# EasyEDA Pro project ProPrj_PCB_Strap_TUT_2025-08-09.epro

# Board PCB Strap TUT
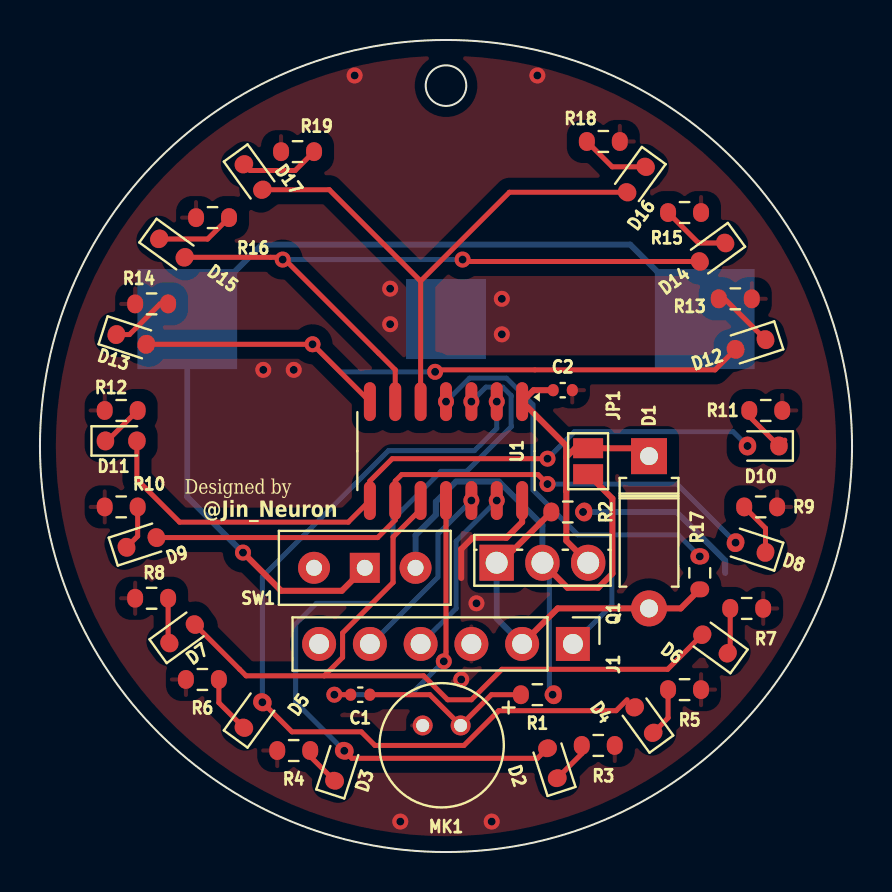
[diagram p0: board, top side]
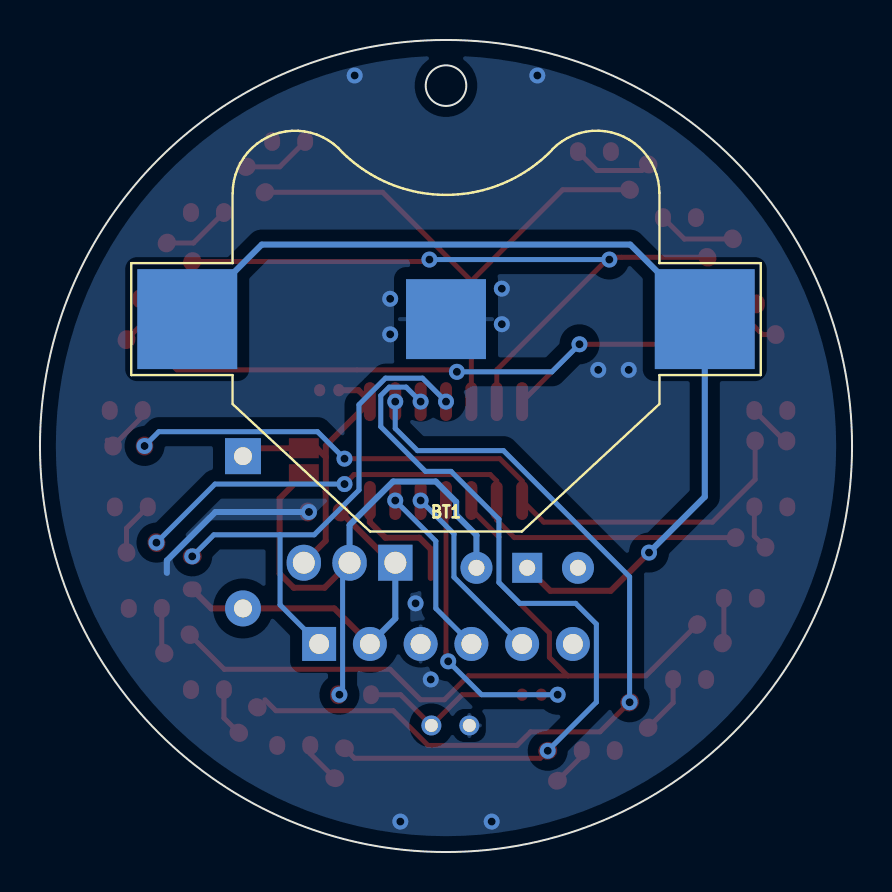
[diagram p1: board, bottom side, seen from below]

Outline 40.64 x 40.64 mm; copper layers: Top Layer, Bottom Layer. Coordinates in mm from the lower left corner of the outline.
Outline path: circle c20.32,38.35 r1.02 ; circle c20.32,20.32 r20.32
Stack: Top Layer 0.035mm / Dielectric1 1.51mm FR4 er 4.5 / Bottom Layer 0.035mm

## Design rules (mm)
spacing safeClearance (default): track to track 0.152, other pairs 0.152 to 0.3
track width trackWidth (default): min 0.127, default 0.254, max 2.54
differential pair differentialPair (default): width min 0.127, default 0.254, max 2.54; gap min 0.152, default 0.152
via viaSize (default): diameter min 0.5, default 0.61, max 10; hole min 0.3, default 0.305, max 6
net GND uses CopperRegion1
pour ie689 uses CopperRegion
pour ie690 uses CopperRegion1

## Placement (name value [footprint] x y rotation side)
BT1  CoinBattery  [Battery:BatteryHolder_Multicomp_BC-2001_1x2032]  20.32 26.67 180 bottom
C1  4.7u  [Capacitor_SMD:C_0402_1005Metric]  16.03 7.87 180 top
C2  104  [Capacitor_SMD:C_0402_1005Metric]  26.16 23.11 0 top
D1  D  [Diode_THT:D_A-405_P7.62mm_Horizontal]  30.48 19.81 270 top
D2  LED  [LED_SMD:LED_0603_1608Metric]  25.64 4.44 108 top
D3  LED  [LED_SMD:LED_0603_1608Metric]  14.99 4.32 72 top
D4  LED  [LED_SMD:LED_0603_1608Metric]  30.23 6.6 126 top
D5  LED  [LED_SMD:LED_0603_1608Metric]  10.67 6.86 54 top
D6  LED  [LED_SMD:LED_0603_1608Metric]  33.78 10.41 144 top
D7  LED  [LED_SMD:LED_0603_1608Metric]  7.11 10.92 36 top
D8  LED  [LED_SMD:LED_0603_1608Metric]  35.56 15.24 162 top
D9  LED  [LED_SMD:LED_0603_1608Metric]  5.08 15.49 18 top
D10  LED  [LED_SMD:LED_0603_1608Metric]  36.19 20.32 180 top
D11  LED  [LED_SMD:LED_0603_1608Metric]  4.06 20.57 0 top
D12  LED  [LED_SMD:LED_0603_1608Metric]  35.56 25.4 198 top
D13  LED  [LED_SMD:LED_0603_1608Metric]  4.57 25.65 342 top
D14  LED  [LED_SMD:LED_0603_1608Metric]  33.66 30.02 216 top
D15  LED  [LED_SMD:LED_0603_1608Metric]  6.6 30.23 324 top
D16  LED  [LED_SMD:LED_0603_1608Metric]  29.84 33.65 234 top
D17  LED  [LED_SMD:LED_0603_1608Metric]  10.67 33.78 306 top
J1  Debug  [Connector_PinHeader_2.54mm:PinHeader_1x06_P2.54mm_Vertical]  26.67 10.41 270 top
JP1  POW_{SEL}  [Jumper:SolderJumper-2_P1.3mm_Bridged_Pad1.0x1.5mm]  27.43 19.56 90 top
MK1  ECM  [Sensor_Audio:POM-2244P-C3310-2-R]  19.15 6.33 0 top
Q1  Q_PMOS_GDS  [Package_TO_SOT_THT:TO-251-3_Vertical]  22.86 14.48 0 top
R1  2.2k  [Resistor_SMD:R_0603_1608Metric]  24.89 7.87 180 top
R2  100k  [Resistor_SMD:R_0603_1608Metric]  26.42 17.02 0 top
R3  1k  [Resistor_SMD:R_0603_1608Metric]  27.94 5.33 0 top
R4  1k  [Resistor_SMD:R_0603_1608Metric]  12.7 5.08 180 top
R5  1k  [Resistor_SMD:R_0603_1608Metric]  32.26 8.13 0 top
R6  1k  [Resistor_SMD:R_0603_1608Metric]  8.13 8.64 180 top
R7  1k  [Resistor_SMD:R_0603_1608Metric]  35.37 12.19 0 top
R8  1k  [Resistor_SMD:R_0603_1608Metric]  5.59 12.7 180 top
R9  1k  [Resistor_SMD:R_0603_1608Metric]  36.07 17.27 0 top
R10  1k  [Resistor_SMD:R_0603_1608Metric]  4.06 17.27 180 top
R11  1k  [Resistor_SMD:R_0603_1608Metric]  36.32 22.1 0 top
R12  1k  [Resistor_SMD:R_0603_1608Metric]  4.06 22.1 180 top
R13  1k  [Resistor_SMD:R_0603_1608Metric]  34.8 27.69 0 top
R14  1k  [Resistor_SMD:R_0603_1608Metric]  5.59 27.43 180 top
R15  1k  [Resistor_SMD:R_0603_1608Metric]  32.26 32 0 top
R16  1k  [Resistor_SMD:R_0603_1608Metric]  8.64 31.75 180 top
R17  5k  [Resistor_SMD:R_0603_1608Metric]  33.02 13.97 270 top
R18  1k  [Resistor_SMD:R_0603_1608Metric]  28.19 35.56 0 top
R19  1k  [Resistor_SMD:R_0603_1608Metric]  12.89 35.05 180 top
SW1  SW_SPST  [Button_Switch_THT:SW_Slide-03_Wuerth-WS-SLTV_10x2.5x6.4_P2.54mm]  16.26 14.22 180 top
U1  PIC16F1503-ISL  [Package_SO:SOIC-14_3.9x8.7mm_P1.27mm]  20.32 20.07 270 top

## Footprints (pads in the part's own frame, mm; a bottom-side part is the same pattern mirrored in y, then rotated)
Battery:BatteryHolder_Multicomp_BC-2001_1x2032
  rect 5x5 smd: 1(-12.95,0) 1(12.95,0)
  rect 4x4 smd: 2(0,0)
Button_Switch_THT:SW_Slide-03_Wuerth-WS-SLTV_10x2.5x6.4_P2.54mm
  rect 1.5x1.5 hole 0.8: 1(0,0)
  round 1.6 hole 0.8: 2(-2.54,0) 3(2.54,0)
Capacitor_SMD:C_0402_1005Metric
  rrect 0.56x0.62 smd: 1(-0.48,0) 2(0.48,0)
Connector_PinHeader_2.54mm:PinHeader_1x06_P2.54mm_Vertical
  rect 1.7x1.7 hole 1: 1(0,0)
  round 1.7 hole 1: 2(0,-2.54) 3(0,-5.08) 4(0,-7.62) 5(0,-10.16) 6(0,-12.7)
Diode_THT:D_A-405_P7.62mm_Horizontal
  rect 1.8x1.8 hole 0.9: 1(0,0)
  round 1.8 hole 0.9: 2(7.62,0)
Jumper:SolderJumper-2_P1.3mm_Bridged_Pad1.0x1.5mm
  rect 1x1.5 smd: 1(-0.65,0) 2(0.65,0)
LED_SMD:LED_0603_1608Metric
  rrect 0.875x0.95 smd: 1(-0.787,0) 2(0.787,0)
Package_SO:SOIC-14_3.9x8.7mm_P1.27mm
  rrect 1.95x0.6 smd: 1(-2.475,3.81) 2(-2.475,2.54) 3(-2.475,1.27) 4(-2.475,0) 5(-2.475,-1.27) 6(-2.475,-2.54) 7(-2.475,-3.81) 8(2.475,-3.81) 9(2.475,-2.54) 10(2.475,-1.27) 11(2.475,0) 12(2.475,1.27) 13(2.475,2.54) 14(2.475,3.81)
Package_TO_SOT_THT:TO-251-3_Vertical
  rect 1.718x1.8 hole 1.1: 1(0,0)
  oval 1.718x1.8 hole 1.1: 2(2.29,0) 3(4.58,0)
Resistor_SMD:R_0603_1608Metric
  rrect 0.8x0.95 smd: 1(-0.825,0) 2(0.825,0)
Sensor_Audio:POM-2244P-C3310-2-R
  rrect 1x1 hole 0.65: 1(0,0)
  round 1 hole 0.65: 2(1.9,0)

## Nets
+3V0: JP1.1 Q1.2 R1.1 SW1.2
+5V: D1.2 J1.2 Q1.1 R2.1 R17.2
GND: BT1.2 C2.2 J1.3 MK1.1 R2.2 R3.2 R4.2 R5.2 R6.2 R7.2 R8.2 R9.2 R10.2 R11.2 R12.2 R13.2 R14.2 R15.2 R16.2 R18.2 R19.2 U1.14
VCC: C2.1 D1.1 JP1.2 Q1.3 U1.1
/PGC: J1.5 U1.12
/PGD: J1.4 U1.13
/RA2: C1.2 U1.11
/RA4: D2.2 D3.2 U1.3
/RA5: D4.2 D5.2 U1.2
/RC0: D6.2 D7.2 U1.10
/RC1: D8.2 D9.2 U1.9
/RC2: D10.2 D11.2 U1.8
/RC3: D12.2 D13.2 U1.7
/RC4: D14.2 D15.2 U1.6
/RC5: D16.2 D17.2 U1.5
/~{CLR}: J1.1 R17.1 U1.4
NET-(BT1-+): BT1.1 SW1.1
NET-(D2-K): D2.1 R3.1
NET-(D3-K): D3.1 R4.1
NET-(D4-K): D4.1 R5.1
NET-(D5-K): D5.1 R6.1
NET-(D6-K): D6.1 R7.1
NET-(D7-K): D7.1 R8.1
NET-(D8-K): D8.1 R9.1
NET-(D9-K): D9.1 R10.1
NET-(D10-K): D10.1 R11.1
NET-(D11-K): D11.1 R12.1
NET-(D12-K): D12.1 R13.1
NET-(D13-K): D13.1 R14.1
NET-(D14-K): D14.1 R15.1
NET-(D15-K): D15.1 R16.1
NET-(D16-K): D16.1 R18.1
NET-(D17-K): D17.1 R19.1
NET-(MK1-+): C1.1 MK1.2 R1.2
UNCONNECTED-(J1-PIN_6-PAD6): J1.6

Pads without a net: SW1 3

## Via types
v1: diameter 0.8, hole 0.4, Top Layer to Bottom Layer, 33 vias

## Routing (per net, layer and track width the routed paths; a pad name or vN(x,y) marks a point on that pad's centre or on a via; arc(x,y) is an arc through that point)
+3V0: length 29.1
  Top Layer w0.3: Q1.2 26.4,13.23 27.94,13.23 28.65,13.94 28.65,17.69 JP1.1
  Bottom Layer w0.25: Q1.2 25.5,14.13 25.5,8.03 v1(25.65,7.87)
  Bottom Layer w0.3: 25.47,14.15 Q1.2 25.15,16.37 22.97,18.54 20.83,18.54 19.81,17.53 19.81,16.87 18.8,15.86 18.8,14.48
+5V: length 18.4
  Top Layer w0.3: J1.2 25.91,12.19 D1.2 32.07,12.19 R17.2 ; R2.1 23.05,14.48 Q1.1
  Bottom Layer w0.3: Q1.1 22.86,11.69 J1.2
GND: length 14.9
  Top Layer w0.3: U1.14 24.13,16.51 23.35,15.73 21.65,15.73 21.08,15.16 21.08,13.72
  Bottom Layer w0.3: 34.29,13.97 34.29,14.59 31.86,17.02 v1(27.18,17.02)
  vias: v1(11.18,24.13) v1(12.7,24.13) v1(15.75,38.86) v1(17.53,28.19) v1(17.53,26.42) v1(18.03,1.52) v1(21.08,8.64) v1(21.84,12.45) v1(22.61,1.52) v1(23.11,27.69) v1(23.11,25.91) v1(24.89,38.86)
VCC: length 15.7
  Top Layer w0.3: D1.1 30.08,20.21 JP1.2 26.78,20.21 26.33,19.76 ; 26.33,19.76 26.33,18.06 26.34,18.05 26.34,15.58 27.44,14.48 ; 26.33,19.76 26.33,20.34 24.13,22.54 24.7,23.11 25.64,23.11
/PGC: length 9.6
  Bottom Layer w0.25: J1.5 16.58,10.41 19.92,13.76 19.92,15.92 v1(21.59,17.59) ; 16.51,10.92 16.83,10.92
/PGD: length 8.8
  Bottom Layer w0.25: J1.4 20.83,12.19 20.83,15.56 v1(22.86,17.59)
/RA2: length 14.8
  Top Layer w0.25: U1.11 20.32,9.65 v1(20.21,9.54) ; C1.2 v1(14.73,7.87)
  Bottom Layer w0.25: 14.97,7.87 18.54,7.87 v1(20.21,9.54)
/RA4: length 38.6
  Top Layer w0.25: D2.2 24.9,4.69 15.61,4.69 v1(15.23,5.07)
  Bottom Layer w0.25: v1(15.23,5.07) 12.79,7.5 12.79,11.41 13.83,12.45 16.63,12.45 17.67,13.49 17.67,16.65 20.07,19.05 21.35,19.05 23.58,21.29 23.58,22.84 23.16,23.27 22.31,23.27 v1(21.59,22.54)
/RA5: length 42.5
  Top Layer w0.25: 29.38,7.62 28.83,7.07 22.96,7.07 21.22,5.33 16.76,5.33 16.08,6.02 12.61,6.02 v1(11.13,7.49)
  Bottom Layer w0.25: v1(11.13,7.49) 11.13,13.78 17.44,20.09 21.75,20.09 22.86,21.2 v1(22.86,22.54)
/RC0: length 39.1
  Top Layer w0.25: 14.22,8.82 10.31,8.82 7.75,11.38 ; 14.22,8.82 15.14,9.74 15.14,10.96 17.67,13.49 17.67,15.77 19.05,17.14 U1.10 ; 14.22,8.82 19.2,8.82 20.4,7.62 21.59,7.62 23.11,9.14 31.41,9.14 33.14,10.88
/RC1: length 32.8
  Top Layer w0.25: D9.2 16.9,15.74 17.78,16.62 U1.9 17.78,18.57 18.1,18.89 24.92,18.89 v1(25.4,18.41)
  Bottom Layer w0.25: v1(34.81,15.48) 31.88,18.41 v1(25.4,18.41)
/RC2: length 36.1
  Top Layer w0.25: v1(25.4,19.68) 17.63,19.68 16.51,18.57 U1.8 15.43,16.51 6.98,16.51 4.85,18.64 D11.2
  Bottom Layer w0.25: v1(25.4,19.68) 26.75,21.04 34.69,21.04 v1(35.41,20.32)
/RC3: length 34.6
  Top Layer w0.25: D12.2 33.78,24.13 19.87,24.13 v1(19.78,24.03) ; 16.51,22.54 v1(13.64,25.41) D13.2
  Bottom Layer w0.25: v1(19.78,24.03) 15.02,24.03 v1(13.64,25.41)
/RC4: length 35.4
  Top Layer w0.25: D14.2 21.25,29.55 v1(21.15,29.65) ; 7.24,29.76 12.15,29.76 17.78,24.13 17.78,22.54
  Bottom Layer w0.25: v1(21.15,29.65) v1(12.15,29.65)
/RC5: length 28
  Top Layer w0.25: D16.2 23.49,33.02 19.05,28.57 ; 19.05,22.54 19.05,28.57 ; 19.05,28.57 14.48,33.14 11.13,33.14
/~{CLR}: length 25.7
  Bottom Layer w0.25: v1(20.32,22.54) 21.5,23.72 23.35,23.72 24.67,22.39 24.67,18.12 26.91,15.88 28.62,15.88 ; 28.62,15.88 28.62,12.37 J1.1 ; 28.62,15.88 31.94,15.88 v1(33.02,14.79)
NET-(BT1-+): length 49.7
  Top Layer w0.3: v1(10.16,14.99) 12.07,13.07 15.11,13.07 SW1.1
  Bottom Layer w0.3: BT1.1 29.54,30.4 11.1,30.4 BT1.1 7.37,17.78 v1(10.16,14.99) ; 16.26,14.48 15.75,14.48
NET-(D2-K): length 2.1
  Top Layer w0.25: D2.1 27.11,4.92 R3.1
NET-(D3-K): length 2
  Top Layer w0.25: D3.1 13.53,4.79 R4.1
NET-(D4-K): length 2.5
  Top Layer w0.25: R5.1 31.43,6.71 D4.1
NET-(D5-K): length 2.9
  Top Layer w0.25: 10.2,6.22 8.95,7.47 R6.1
NET-(D6-K): length 2.3
  Top Layer w0.25: R7.1 34.54,10.08 34.42,9.95
NET-(D7-K): length 2.3
  Top Layer w0.25: 6.47,10.46 6.41,10.52 R8.1
NET-(D8-K): length 2.7
  Top Layer w0.25: D8.1 36.31,16.21 R9.1
NET-(D9-K): length 2.3
  Top Layer w0.25: R10.1 4.89,15.81 D9.1
NET-(D10-K): length 2.8
  Top Layer w0.25: 37.28,20.61 D10.1 35.5,21.81 35.5,22.1
NET-(D11-K): length 2.4
  Top Layer w0.25: 3.17,20.68 D11.1 3.36,20.57 R12.1
NET-(D12-K): length 3.2
  Top Layer w0.25: 33.97,27.69 34.27,27.69 D12.1
NET-(D13-K): length 3.2
  Top Layer w0.25: 3.82,25.9 4.48,25.9 6.01,27.43 R14.1
NET-(D14-K): length 3.5
  Top Layer w0.25: D14.1 32.96,30.48 R15.1
NET-(D15-K): length 3.9
  Top Layer w0.25: R16.1 8.39,30.68 5.98,30.68 5.97,30.69
NET-(D16-K): length 3.5
  Top Layer w0.25: R18.1 28.64,34.29 D16.1
NET-(D17-K): length 4
  Top Layer w0.25: R19.1 12.77,34.11 10.52,34.11 10.2,34.42
NET-(MK1-+): length 8.8
  Top Layer w0.25: R1.2 22.59,7.87 MK1.2 19.51,7.87 16.52,7.87

## Copper pours and planes (outline as drawn; the poured copper is in the pictures)
GND on Top Layer: 40.15,20.32 40.13,21.21 40.07,22.1 39.97,22.98 39.83,23.86 39.65,24.73 39.43,25.59 39.18,26.45 38.88,27.29 38.55,28.11 38.18,28.92 37.78,29.71 37.34,30.49 36.87,31.24 36.36,31.97 35.82,32.68 35.25,33.36 34.65,34.02 34.02,34.65 33.36,35.25 32.68,35.82 31.97,36.36 31.24,36.87 30.49,37.34 29.72,37.78 28.92,38.18 28.11,38.55 27.29,38.88 26.45,39.18 25.59,39.43 24.73,39.65 23.86,39.83 22.98,39.97 22.1,40.07 21.21,40.13 20.32,40.15 19.43,40.13 18.54,40.07 17.66,39.97 16.78,39.83 15.91,39.65 15.05,39.43 14.19,39.18 13.35,38.88 12.53,38.55 11.72,38.18 10.92,37.78 10.15,37.34 9.4,36.87 8.67,36.36 7.96,35.82 7.28,35.25 6.62,34.65 5.99,34.02 5.39,33.36 4.82,32.68 4.28,31.97 3.77,31.24 3.3,30.49 2.86,29.71 2.46,28.92 2.09,28.11 1.76,27.29 1.46,26.45 1.21,25.59 0.99,24.73 0.81,23.86 0.67,22.98 0.57,22.1 0.51,21.21 0.49,20.32 0.51,19.43 0.57,18.54 0.67,17.66 0.81,16.78 0.99,15.91 1.21,15.05 1.46,14.19 1.76,13.35 2.09,12.53 2.46,11.72 2.86,10.92 3.3,10.15 3.77,9.4 4.28,8.67 4.82,7.96 5.39,7.28 5.99,6.62 6.62,5.99 7.28,5.39 7.96,4.82 8.67,4.28 9.4,3.77 10.15,3.3 10.92,2.86 11.72,2.46 12.53,2.09 13.35,1.76 14.19,1.46 15.05,1.21 15.91,0.99 16.78,0.81 17.66,0.67 18.54,0.57 19.43,0.51 20.32,0.49 21.21,0.51 22.1,0.57 22.98,0.67 23.86,0.81 24.73,0.99 25.59,1.21 26.45,1.46 27.29,1.76 28.11,2.09 28.92,2.46 29.72,2.86 30.49,3.3 31.24,3.77 31.97,4.28 32.68,4.82 33.36,5.39 34.02,5.99 34.65,6.62 35.25,7.28 35.82,7.96 36.36,8.67 36.87,9.4 37.34,10.15 37.78,10.92 38.18,11.72 38.55,12.53 38.88,13.35 39.18,14.19 39.43,15.05 39.65,15.91 39.83,16.78 39.97,17.66 40.07,18.54 40.13,19.43
GND on Bottom Layer: 40.15,20.32 40.13,21.21 40.07,22.1 39.97,22.98 39.83,23.86 39.65,24.73 39.43,25.59 39.18,26.45 38.88,27.29 38.55,28.11 38.18,28.92 37.78,29.71 37.34,30.49 36.87,31.24 36.36,31.97 35.82,32.68 35.25,33.36 34.65,34.02 34.02,34.65 33.36,35.25 32.68,35.82 31.97,36.36 31.24,36.87 30.49,37.34 29.72,37.78 28.92,38.18 28.11,38.55 27.29,38.88 26.45,39.18 25.59,39.43 24.73,39.65 23.86,39.83 22.98,39.97 22.1,40.07 21.21,40.13 20.32,40.15 19.43,40.13 18.54,40.07 17.66,39.97 16.78,39.83 15.91,39.65 15.05,39.43 14.19,39.18 13.35,38.88 12.53,38.55 11.72,38.18 10.92,37.78 10.15,37.34 9.4,36.87 8.67,36.36 7.96,35.82 7.28,35.25 6.62,34.65 5.99,34.02 5.39,33.36 4.82,32.68 4.28,31.97 3.77,31.24 3.3,30.49 2.86,29.71 2.46,28.92 2.09,28.11 1.76,27.29 1.46,26.45 1.21,25.59 0.99,24.73 0.81,23.86 0.67,22.98 0.57,22.1 0.51,21.21 0.49,20.32 0.51,19.43 0.57,18.54 0.67,17.66 0.81,16.78 0.99,15.91 1.21,15.05 1.46,14.19 1.76,13.35 2.09,12.53 2.46,11.72 2.86,10.92 3.3,10.15 3.77,9.4 4.28,8.67 4.82,7.96 5.39,7.28 5.99,6.62 6.62,5.99 7.28,5.39 7.96,4.82 8.67,4.28 9.4,3.77 10.15,3.3 10.92,2.86 11.72,2.46 12.53,2.09 13.35,1.76 14.19,1.46 15.05,1.21 15.91,0.99 16.78,0.81 17.66,0.67 18.54,0.57 19.43,0.51 20.32,0.49 21.21,0.51 22.1,0.57 22.98,0.67 23.86,0.81 24.73,0.99 25.59,1.21 26.45,1.46 27.29,1.76 28.11,2.09 28.92,2.46 29.72,2.86 30.49,3.3 31.24,3.77 31.97,4.28 32.68,4.82 33.36,5.39 34.02,5.99 34.65,6.62 35.25,7.28 35.82,7.96 36.36,8.67 36.87,9.4 37.34,10.15 37.78,10.92 38.18,11.72 38.55,12.53 38.88,13.35 39.18,14.19 39.43,15.05 39.65,15.91 39.83,16.78 39.97,17.66 40.07,18.54 40.13,19.43

## Text on the board
Top Silkscreen Layer: @Jin_Neuron | Designed by
